# Altium schematic sheet isa_opl2.SchDoc
size 279 x 215 mm
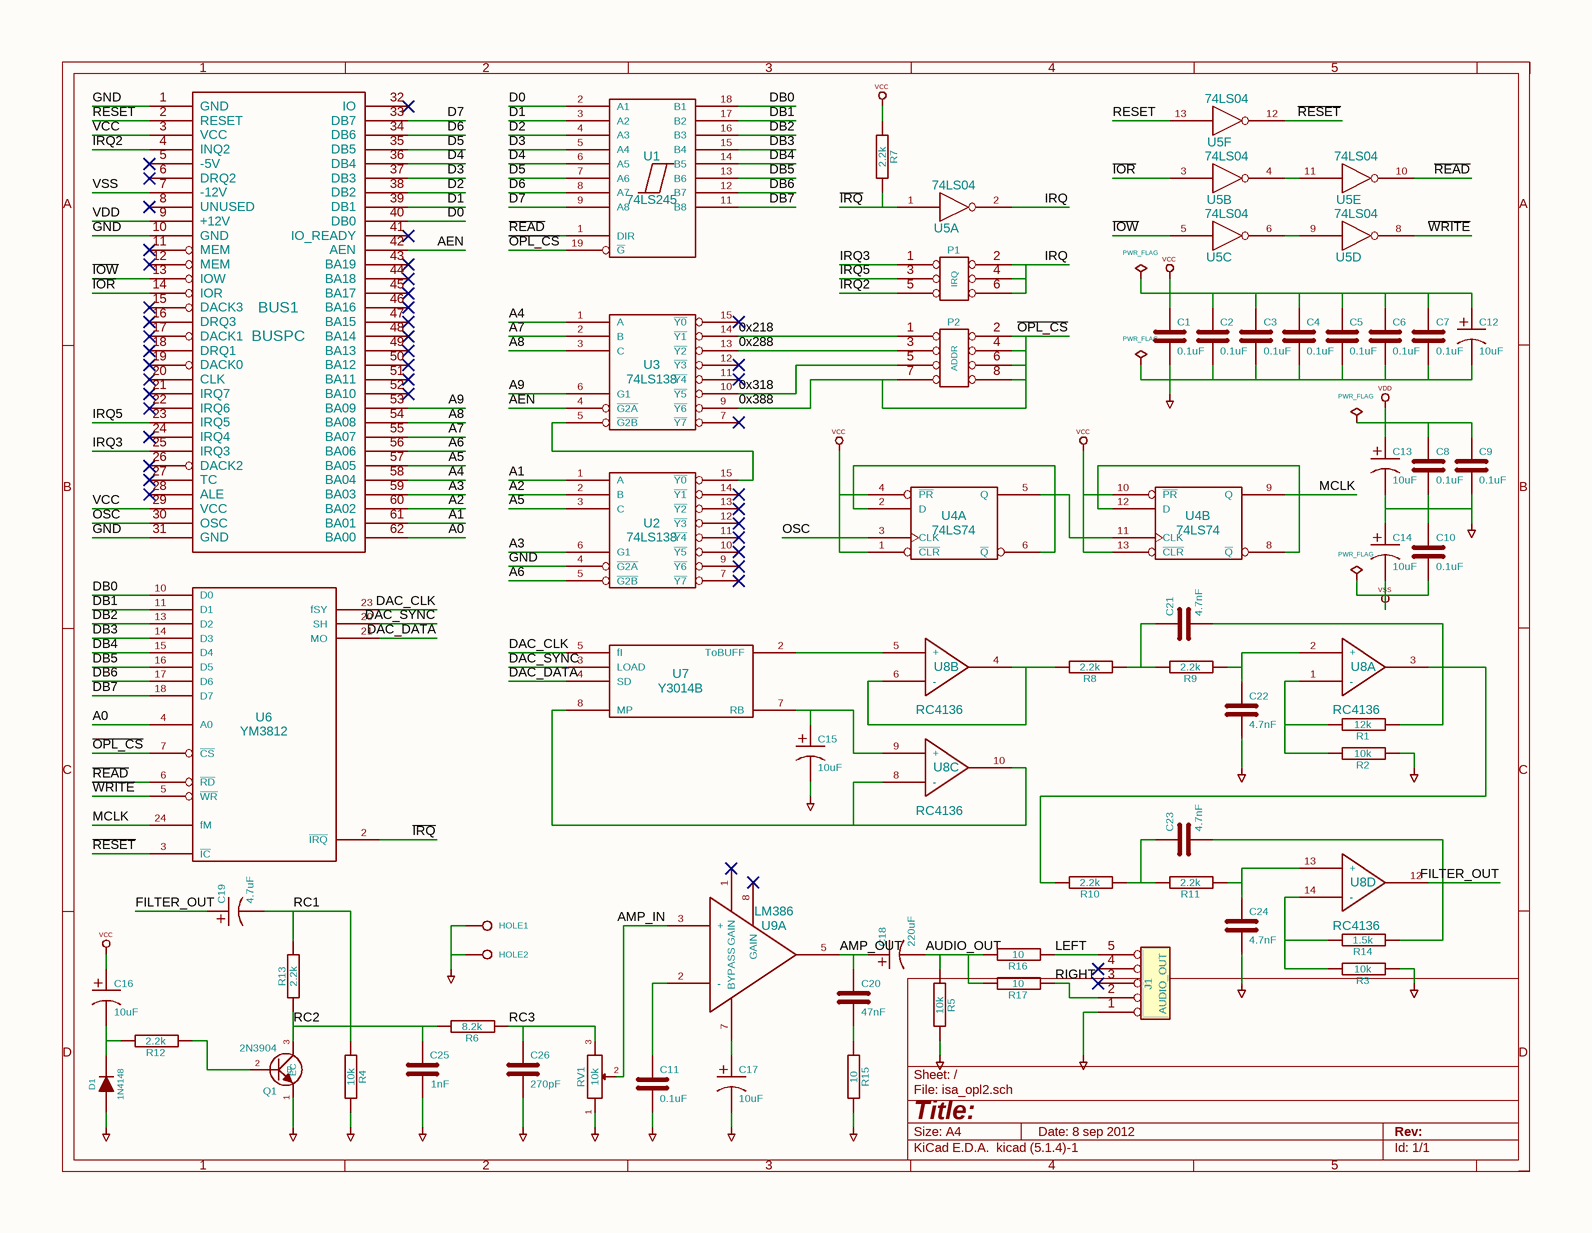
[diagram p0: isa_opl2.SchDoc]

## Parts
#FLG02  PWR_FLAG  (graphical)
#FLG03  PWR_FLAG  (graphical)
#FLG04  PWR_FLAG  (graphical)
#FLG05  PWR_FLAG  (graphical)
BUS1  BUSPC
C1  0.1uF
C2  0.1uF
C3  0.1uF
C4  0.1uF
C5  0.1uF
C6  0.1uF
C7  0.1uF
C8  0.1uF
C9  0.1uF
C10  0.1uF
C11  0.1uF
C12  10uF
C13  10uF
C14  10uF
C15  10uF
C16  10uF
C17  10uF
C18  220uF
C19  4.7uF
C20  47nF
C21  4.7nF
C22  4.7nF
C23  4.7nF
C24  4.7nF
C25  1nF
C26  270pF
D1  1N4148
HOLE1  CONN_1  (value not drawn)
HOLE2  CONN_1  (value not drawn)
J1  AUDIO_OUT
P1  IRQ
P2  ADDR
Q1  2N3904
R1  12k
R2  10k
R3  10k
R4  10k
R5  10k
R6  8.2k
R7  2.2k
R8  2.2k
R9  2.2k
R10  2.2k
R11  2.2k
R12  2.2k
R13  2.2k
R14  1.5k
R15  10
R16  10
R17  10
RV1  10k
U1  74LS245
U2  74LS138
U3  74LS138
U4  74LS74  (parts A,B of 2)
U5  74LS04  (parts A,B,C,D,E,F of 6)
U6  YM3812
U7  Y3014B
U8  RC4136  (parts A,B,C,D of 4)
U9  LM386  (part A of 4)

## Nets
GND: #FLG02.1(pwr) BUS1.1(GND) BUS1.10(GND) BUS1.31(GND) C1.2 C2.2 C3.2 C4.2 C5.2 C6.2 C7.2 C8.2 C9.2 C10.1 C11.2 C12.2 C13.2 C14.1 C15.2 C17.2 C22.2 C24.2 C25.1 C26.2 D1.1(A) HOLE1.1 HOLE2.1 J1.1 Q1.1(E) R2.1 R3.1 R4.2 R5.2 R15.2 RV1.1 U2.4(~{G2A})
VCC: #FLG05.1(pwr) BUS1.3(VCC) BUS1.29(VCC) C1.1 C2.1 C3.1 C4.1 C5.1 C6.1 C7.1 C12.1 C16.1 R7.1 U4.1(~{CLR}) U4.4(~{PR}) U4.10(~{PR}) U4.13(~{CLR})
VDD: #FLG04.1(pwr) BUS1.9(+12V) C8.1 C9.1 C13.1
VSS: #FLG03.1(pwr) BUS1.7(-12V) C10.2 C14.2
0x218: P2.1 U3.14(~{Y1})
0x288: P2.3 U3.13(~{Y2})
0x318: P2.5 U3.10(~{Y5})
0x388: P2.2 P2.4 P2.6 P2.7 P2.8 U1.19(~{G}) U3.9(~{Y6}) U6.7(~{CS})  [also labelled ~{OPL_CS}]
A0: BUS1.62(BA00) U6.4(A0)
A1: BUS1.61(BA01) U2.1(A)
A2: BUS1.60(BA02) U2.2(B)
A3: BUS1.59(BA03) U2.6(G1)
A4: BUS1.58(BA04) U3.1(A)
A5: BUS1.57(BA05) U2.3(C)
A6: BUS1.56(BA06) U2.5(~{G2B})
A7: BUS1.55(BA07) U3.2(B)
A8: BUS1.54(BA08) U3.3(C)
A9: BUS1.53(BA09) U3.6(G1)
AEN: BUS1.42(AEN) U3.4(~{G2A})
AMP_IN: RV1.2 U9.3(+)
AMP_OUT: C18.1 C20.1 U9.5
AUDIO_OUT: C18.2 R5.1 R16.2 R17.2
D0: BUS1.40(DB0) U1.2(A1)
D1: BUS1.39(DB1) U1.3(A2)
D2: BUS1.38(DB2) U1.4(A3)
D3: BUS1.37(DB3) U1.5(A4)
D4: BUS1.36(DB4) U1.6(A5)
D5: BUS1.35(DB5) U1.7(A6)
D6: BUS1.34(DB6) U1.8(A7)
D7: BUS1.33(DB7) U1.9(A8)
DAC_CLK: U6.23(fSY) U7.5(fI)
DAC_DATA: U6.21(MO) U7.4(SD)
DAC_SYNC: U6.20(SH) U7.3(LOAD)
DB0: U1.18(B1) U6.10(D0)
DB1: U1.17(B2) U6.11(D1)
DB2: U1.16(B3) U6.13(D2)
DB3: U1.15(B4) U6.14(D3)
DB4: U1.14(B5) U6.15(D4)
DB5: U1.13(B6) U6.16(D5)
DB6: U1.12(B7) U6.17(D6)
DB7: U1.11(B8) U6.18(D7)
FILTER_OUT: C19.1 C23.2 R14.1 U8.12
~{IOR}: BUS1.14(IOR) U5.3
~{IOW}: BUS1.13(IOW) U5.5
~{IRQ}: R7.2 U5.1 U6.2(~{IRQ})
IRQ: P1.2 P1.4 P1.6 U5.2
IRQ2: BUS1.4(INQ2) P1.5
IRQ3: BUS1.25(IRQ3) P1.1
IRQ5: BUS1.23(IRQ5) P1.3
LEFT: J1.5 R16.1
MCLK: U4.9(Q) U6.24(fM)
OSC: BUS1.30(OSC) U4.3(CLK)
~{READ}: U1.1(DIR) U5.10 U6.6(~{RD})
~{RESET}: U5.12 U6.3(~{IC})
RC1: C19.2 R4.1 R13.2
RC2: C25.2 Q1.3(C) R6.2 R13.1
RC3: C26.1 R6.1 RV1.3
RESET: BUS1.2(RESET) U5.13
RIGHT: J1.2 R17.1
~{WRITE}: U5.8 U6.5(~{WR})
NetC11_1: C11.1 U9.2(-)
NetC15_1: C15.1 U7.7(RB) U8.9(+)
NetC16_2: C16.2 D1.2(K) R12.2
NetC17_1: C17.1 U9.7(BYPASS)
NetC20_2: C20.2 R15.1
NetC21_1: C21.1 R8.1 R9.2
NetC21_2: C21.2 R1.1 R10.2 U8.3
NetC22_1: C22.1 R9.1 U8.2(+)
NetC23_1: C23.1 R10.1 R11.2
NetC24_1: C24.1 R11.1 U8.13(+)
NetQ1_2: Q1.2(B) R12.1
NetR1_2: R1.2 R2.2 U8.1(-)
NetR3_2: R3.2 R14.2 U8.14(-)
NetR8_2: R8.2 U8.4 U8.6(-)
NetU2_15: U2.15(~{Y0}) U3.5(~{G2B})
NetU4_2: U4.2(D) U4.6(~{Q})
NetU4_5: U4.5(Q) U4.11(CLK)
NetU4_8: U4.8(~{Q}) U4.12(D)
NetU5_4: U5.4 U5.11
NetU5_6: U5.6 U5.9
NetU7_2: U7.2(ToBUFF) U8.5(+)
NetU7_8: U7.8(MP) U8.8(-) U8.10

Not connected (* = marked no-connect by the designer): BUS1 5(-5V)* 6(DRQ2)* 8(UNUSED)* 11(MEM)* 12(MEM)* 15(DACK3)* 16(DRQ3)* 17(DACK1)* 18(DRQ1)* 19(DACK0)* 20(CLK)* 21(IRQ7)* 22(IRQ6)* 24(IRQ4)* 26(DACK2)* 27(TC)* 28(ALE)* 32(IO)* 41(IO_READY)* 43(BA19)* 44(BA18)* 45(BA17)* 46(BA16)* 47(BA15)* 48(BA14)* 49(BA13)* 50(BA12)* 51(BA11)* 52(BA10)*; J1 3* 4*; U1 10(GND) 20(VCC); U2 7(~{Y7})* 8(GND) 9(~{Y6})* 10(~{Y5})* 11(~{Y4})* 12(~{Y3})* 13(~{Y2})* 14(~{Y1})* 16(VCC); U3 7(~{Y7})* 8(GND) 11(~{Y4})* 12(~{Y3})* 15(~{Y0})* 16(VCC); U4 7(GND) 14(VCC); U5 7(GND) 14(VCC); U6 1(VCC) 12(GND); U7 1(VCC) 6(GND); U8 7(VSS) 11(VDD); U9 1(GAIN)* 4(GND) 6(VDD) 8(GAIN)*

## Notes on the sheet
- 1
- 2
- 3
- 4
- 5
- A
- B
- C
- D
- Title:
- File: isa_opl2.sch
- Sheet: /
- KiCad E.D.A.  kicad (5.1.4)-1
- Size: A4
- Date: 8 sep 2012
- Rev:
- Id: 1/1
- (in symbol CP1) +

## Library data of the parts
C1-C11 C20-C26 = C
  C1-C11: Value: 0.1uF
  C20: Value: 47nF
  C21-C24: Value: 4.7nF
  C25: Value: 1nF
  C26: Value: 270pF
C12-C19 = CP1
  C12-C17: Value: 10uF
  C18: Value: 220uF
  C19: Value: 4.7uF
D1 = DIODE: Value: 1N4148
J1 = CONN_5: Value: AUDIO_OUT
P1 = CONN_3X2: Value: IRQ
P2 = CONN_4X2: Value: ADDR
Q1 = NPN: Value: 2N3904
R1-R17 = R
  R1: Value: 12k
  R2-R5: Value: 10k
  R6: Value: 8.2k
  R7-R13: Value: 2.2k
  R14: Value: 1.5k
  R15-R17: Value: 10
RV1 = POT: Value: 10k
#FLG02 #FLG03 #FLG04 #FLG05 = PWR_FLAG: Value: PWR_FLAG
BUS1 = BUSPC: Value: BUSPC
HOLE1 HOLE2 = CONN_1: Value: CONN_1
U1 = 74LS245: Value: 74LS245
U2 U3 = 74LS138: Value: 74LS138
U4 = 74LS74: Value: 74LS74
U5 = 74LS04: Value: 74LS04
U6 = YM3812: Value: YM3812
U7 = Y3014B: Value: Y3014B
U8 = RC4136: Value: RC4136
U9 = LM386: Value: LM386